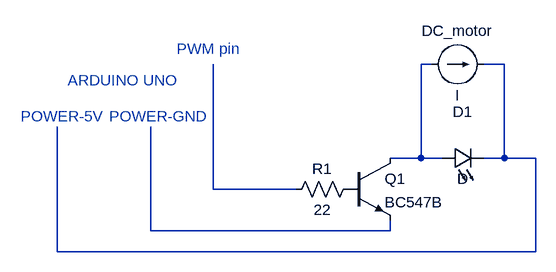
[diagram p0: schematic Power_pump.asc]
Power_pump.asc, the LTspice schematic file:
Version 4
SHEET 1 880 680
WIRE 544 160 528 160
WIRE 656 160 624 160
WIRE 528 304 528 160
WIRE 528 304 480 304
WIRE 560 304 528 304
WIRE 656 304 656 160
WIRE 656 304 624 304
WIRE 704 304 656 304
WIRE 208 352 208 160
WIRE 336 352 208 352
WIRE 112 416 112 256
WIRE 480 416 480 400
WIRE 480 416 112 416
WIRE -32 448 -32 256
WIRE 704 448 704 304
WIRE 704 448 -32 448
SYMBOL npn 416 304 R0
SYMATTR InstName Q1
SYMATTR Value BC547B
SYMBOL LED 560 320 R270
WINDOW 0 72 32 VTop 2
WINDOW 3 0 32 VBottom 2
SYMATTR InstName D1
SYMBOL load2 544 160 R270
WINDOW 0 36 40 VTop 2
WINDOW 3 -32 40 VBottom 2
SYMATTR InstName DC_motor
SYMBOL res 432 336 R90
WINDOW 0 0 56 VBottom 2
WINDOW 3 32 56 VTop 2
SYMATTR InstName R1
SYMATTR Value 22
TEXT 152 136 Left 2 ;PWM pin
TEXT 48 240 Left 2 ;POWER-GND
TEXT -88 240 Left 2 ;POWER-5V
TEXT -16 184 Left 2 ;ARDUINO UNO

The netlist it stands for:
* Power_pump.asc
Q1 N001 P001 N004 0 BC547B
D1 N001 N002 D
I§DC_motor N001 N002 I
R1 P001 N003 22
.model D D
.lib standard.dio
.model NPN NPN
.model PNP PNP
.lib standard.bjt
* PWM pin
* POWER-GND
* POWER-5V
* ARDUINO UNO
.backanno
.end